# Altium schematic sheet Reference Schematic_2021-02-27.schdoc
size 1415 x 404 mm
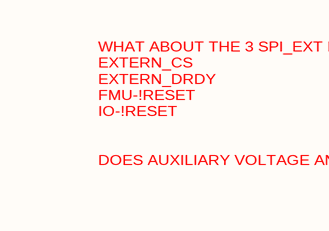
[diagram p0: Reference Schematic_2021-02-27.schdoc, top left]
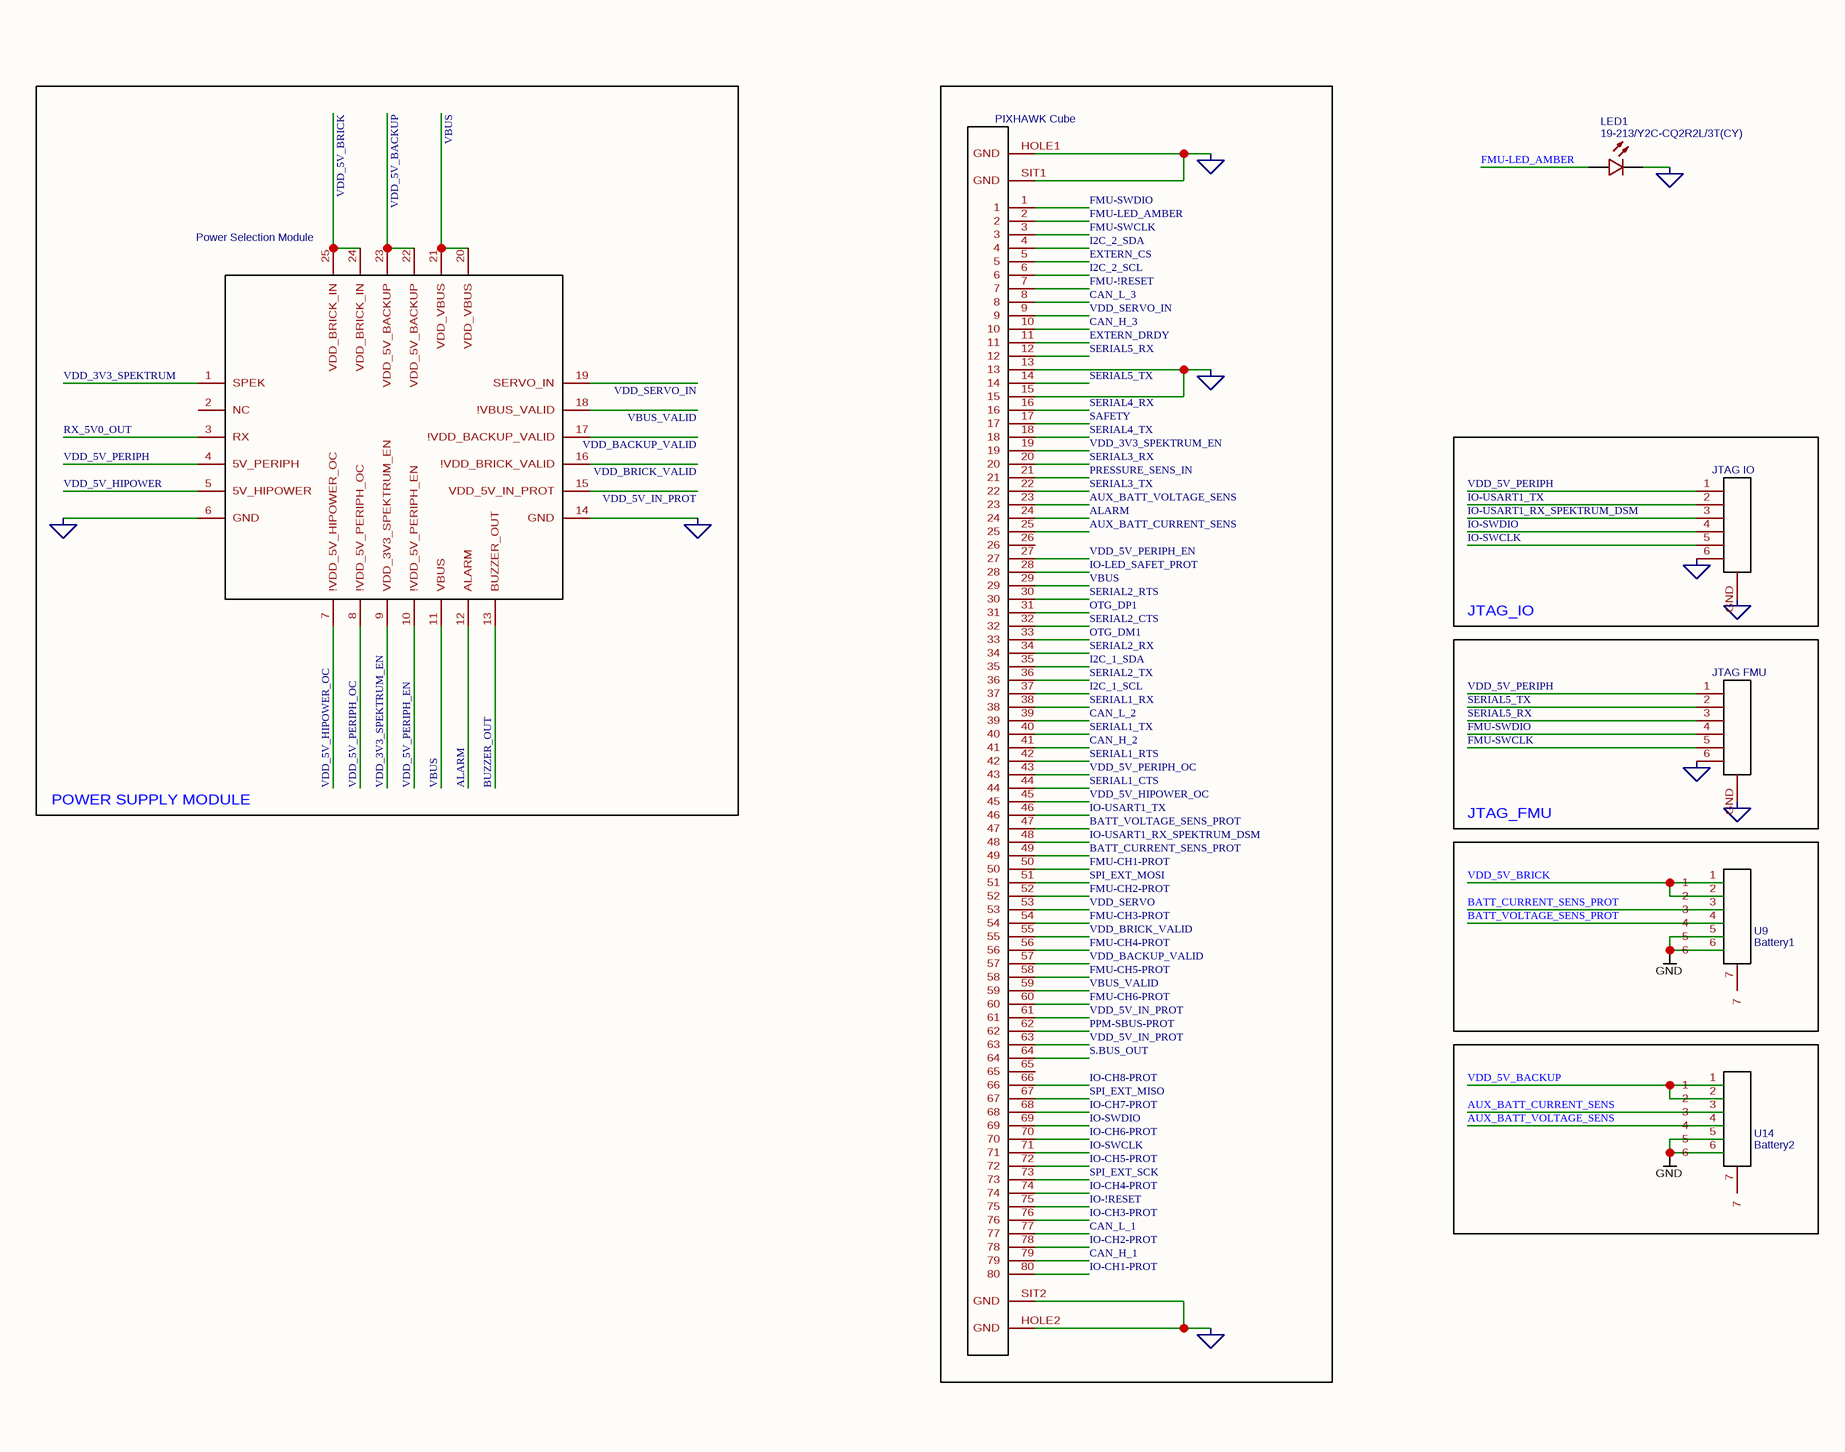
[diagram p1: Reference Schematic_2021-02-27.schdoc, bottom left]
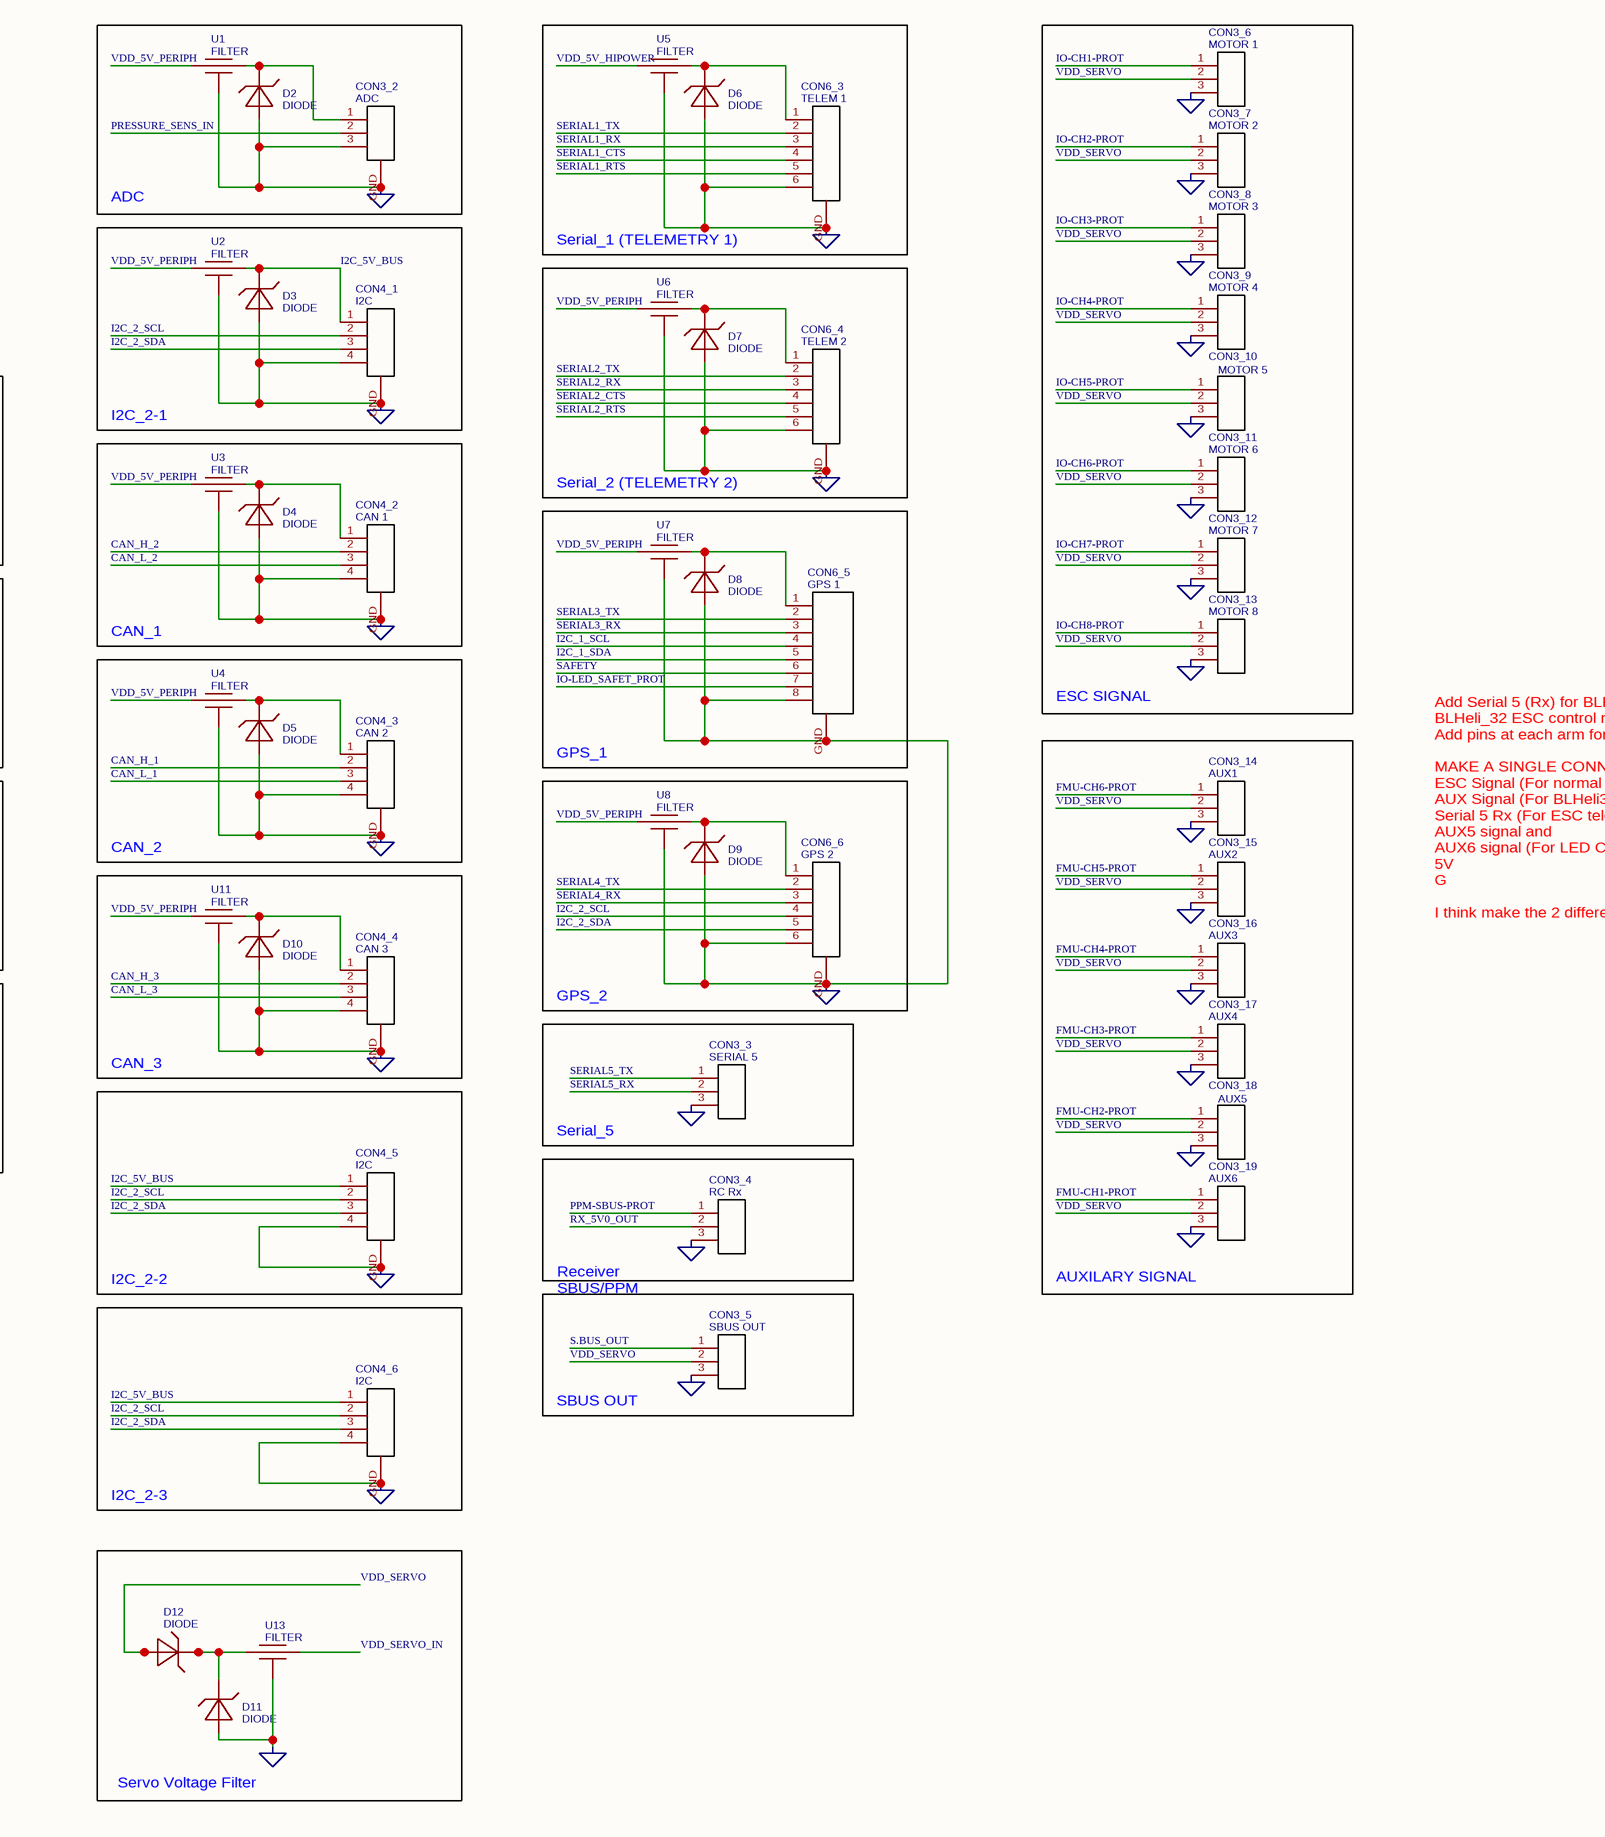
[diagram p2: Reference Schematic_2021-02-27.schdoc, bottom right]

## Parts
CON3_2  ADC  [BM03B-GHS-TBT]
CON3_3  SERIAL 5  [3X1 THROUGH HOLE HEADER]
CON3_4  RC Rx  [3X1 SERVO HEADER]
CON3_5  SBUS OUT  [3X1 SERVO HEADER]
CON3_6  MOTOR 1  [3X1 SERVO HEADER]
CON3_7  MOTOR 2  [3X1 SERVO HEADER]
CON3_8  MOTOR 3  [3X1 SERVO HEADER]
CON3_9  MOTOR 4  [3X1 SERVO HEADER]
CON3_10  MOTOR 5  [3X1 SERVO HEADER]
CON3_11  MOTOR 6  [3X1 SERVO HEADER]
CON3_12  MOTOR 7  [3X1 SERVO HEADER]
CON3_13  MOTOR 8  [3X1 SERVO HEADER]
CON3_14  AUX1  [3X1 THROUGH HOLE HEADER]
CON3_15  AUX2  [3X1 THROUGH HOLE HEADER]
CON3_16  AUX3  [3X1 THROUGH HOLE HEADER]
CON3_17  AUX4  [3X1 THROUGH HOLE HEADER]
CON3_18  AUX5  [3X1 THROUGH HOLE HEADER]
CON3_19  AUX6  [3X1 THROUGH HOLE HEADER]
CON4_1  I2C  [BM04B-GHS-TBT]
CON4_2  CAN 1  [BM04B-GHS-TBT]
CON4_3  CAN 2  [BM04B-GHS-TBT]
CON4_4  CAN 3  [BM04B-GHS-TBT]
CON4_5  I2C  [BM04B-GHS-TBT]
CON4_6  I2C  [BM04B-GHS-TBT]
CON6_1  JTAG IO  [SM06B-SURS-TF]
CON6_2  JTAG FMU  [SM06B-SURS-TF]
CON6_3  TELEM 1  [BM06B-GHS-TBT]
CON6_4  TELEM 2  [BM06B-GHS-TBT]
CON6_5  GPS 1  [BM08B-GHS-TBT]
CON6_6  GPS 2  [BM06B-GHS-TBT]
D2  DIODE  [0402 DIODE]
D3  DIODE  [0402 DIODE]
D4  DIODE  [0402 DIODE]
D5  DIODE  [0402 DIODE]
D6  DIODE  [0402 DIODE]
D7  DIODE  [0402 DIODE]
D8  DIODE  [0402 DIODE]
D9  DIODE  [0402 DIODE]
D10  DIODE  [0402 DIODE]
D11  DIODE  [0402 DIODE]
D12  DIODE  [MSS1P4-M3/89A DIODE]
DF17(1.0H)-80DP-0.5V(57)  PIXHAWK Cube  [CON-DF17-80M]
LED1  19-213/Y2C-CQ2R2L/3T(CY)  [LED0603-R-RD]
PSM  Power Selection Module  [POWER SELECTION MODULE]
U1  FILTER  [0603 LC EMI FILTER]
U2  FILTER  [0603 LC EMI FILTER]
U3  FILTER  [0603 LC EMI FILTER]
U4  FILTER  [0603 LC EMI FILTER]
U5  FILTER  [0603 LC EMI FILTER]
U6  FILTER  [0603 LC EMI FILTER]
U7  FILTER  [0603 LC EMI FILTER]
U8  FILTER  [0603 LC EMI FILTER]
U9  Battery1  [MOLEX CLICKMATE 2.0-6P]
U11  FILTER  [0603 LC EMI FILTER]
U13  FILTER  [0603 LC EMI FILTER]
U14  Battery2  [MOLEX CLICKMATE 2.0-6P]

## Blocks framed on the sheet
POWER SUPPLY MODULE: PSM
ADC: CON3_2 D2 U1
Serial_1 (TELEMETRY 1): CON6_3 D6 U5
ESC SIGNAL: CON3_6-CON3_13
I2C_2-1: CON4_1 D3 U2
Serial_2 (TELEMETRY 2): CON6_4 D7 U6
JTAG_IO: CON6_1
CAN_1: CON4_2 D4 U3
GPS_1: CON6_5 D8 U7
JTAG_FMU: CON6_2
CAN_2: CON4_3 D5 U4
AUXILARY SIGNAL: CON3_14-CON3_19
GPS_2: CON6_6 D9 U8
CAN_3: CON4_4 D10 U11
Serial_5: CON3_3
I2C_2-2: CON4_5
I2C_2-3: CON4_6
SBUS OUT: CON3_5
Servo Voltage Filter: D11 D12 U13

## Nets
GND: CON3_2.3 CON3_2.GND CON3_3.3 CON3_4.3 CON3_5.3 CON3_6.3 CON3_7.3 CON3_8.3 CON3_9.3 CON3_10.3 CON3_11.3 CON3_12.3 CON3_13.3 CON3_14.3 CON3_15.3 CON3_16.3 CON3_17.3 CON3_18.3 CON3_19.3 CON4_1.4 CON4_1.GND CON4_2.4 CON4_2.GND CON4_3.4 CON4_3.GND CON4_4.4 CON4_4.GND CON4_5.4 CON4_5.GND CON4_6.4 CON4_6.GND CON6_1.6 CON6_1.GND CON6_2.6 CON6_2.GND CON6_3.6 CON6_3.GND CON6_4.6 CON6_4.GND CON6_5.8 CON6_5.GND CON6_6.6 CON6_6.GND D2.2 D3.2 D4.2 D5.2 D6.2 D7.2 D8.2 D9.2 D10.2 D11.2 DF17(1.0H)-80DP-0.5V(57).13 DF17(1.0H)-80DP-0.5V(57).15 DF17(1.0H)-80DP-0.5V(57).HOLE1(GND) DF17(1.0H)-80DP-0.5V(57).HOLE2(GND) DF17(1.0H)-80DP-0.5V(57).SIT1(GND) DF17(1.0H)-80DP-0.5V(57).SIT2(GND) LED1.2(C) PSM.6(GND) PSM.14(GND) U1.GND U2.GND U3.GND U4.GND U5.GND U6.GND U7.GND U8.GND U9.5 U9.6 U11.GND U13.GND U14.5 U14.6
ALARM: DF17(1.0H)-80DP-0.5V(57).24 PSM.12(ALARM)
AUX_BATT_CURRENT_SENS: DF17(1.0H)-80DP-0.5V(57).25 U14.3
AUX_BATT_VOLTAGE_SENS: DF17(1.0H)-80DP-0.5V(57).23 U14.4
BATT_CURRENT_SENS_PROT: DF17(1.0H)-80DP-0.5V(57).49 U9.3
BATT_VOLTAGE_SENS_PROT: DF17(1.0H)-80DP-0.5V(57).47 U9.4
BUZZER_OUT: PSM.13(BUZZER_OUT)
CAN_H_1: CON4_3.2 DF17(1.0H)-80DP-0.5V(57).79
CAN_H_2: CON4_2.2 DF17(1.0H)-80DP-0.5V(57).41
CAN_H_3: CON4_4.2 DF17(1.0H)-80DP-0.5V(57).10
CAN_L_1: CON4_3.3 DF17(1.0H)-80DP-0.5V(57).77
CAN_L_2: CON4_2.3 DF17(1.0H)-80DP-0.5V(57).39
CAN_L_3: CON4_4.3 DF17(1.0H)-80DP-0.5V(57).8
EXTERN_CS: DF17(1.0H)-80DP-0.5V(57).5
EXTERN_DRDY: DF17(1.0H)-80DP-0.5V(57).11
FMU-!RESET: DF17(1.0H)-80DP-0.5V(57).7
FMU-CH1-PROT: CON3_19.1 DF17(1.0H)-80DP-0.5V(57).50
FMU-CH2-PROT: CON3_18.1 DF17(1.0H)-80DP-0.5V(57).52
FMU-CH3-PROT: CON3_17.1 DF17(1.0H)-80DP-0.5V(57).54
FMU-CH4-PROT: CON3_16.1 DF17(1.0H)-80DP-0.5V(57).56
FMU-CH5-PROT: CON3_15.1 DF17(1.0H)-80DP-0.5V(57).58
FMU-CH6-PROT: CON3_14.1 DF17(1.0H)-80DP-0.5V(57).60
FMU-LED_AMBER: DF17(1.0H)-80DP-0.5V(57).2 LED1.1(A)
FMU-SWCLK: CON6_2.5 DF17(1.0H)-80DP-0.5V(57).3
FMU-SWDIO: CON6_2.4 DF17(1.0H)-80DP-0.5V(57).1
I2C_1_SCL: CON6_5.4 DF17(1.0H)-80DP-0.5V(57).37
I2C_1_SDA: CON6_5.5 DF17(1.0H)-80DP-0.5V(57).35
I2C_2_SCL: CON4_1.2 CON4_5.2 CON4_6.2 CON6_6.4 DF17(1.0H)-80DP-0.5V(57).6
I2C_2_SDA: CON4_1.3 CON4_5.3 CON4_6.3 CON6_6.5 DF17(1.0H)-80DP-0.5V(57).4
I2C_5V_BUS: CON4_1.1 CON4_5.1 CON4_6.1 D3.1 U2.2
IO-!RESET: DF17(1.0H)-80DP-0.5V(57).75
IO-CH1-PROT: CON3_6.1 DF17(1.0H)-80DP-0.5V(57).80
IO-CH2-PROT: CON3_7.1 DF17(1.0H)-80DP-0.5V(57).78
IO-CH3-PROT: CON3_8.1 DF17(1.0H)-80DP-0.5V(57).76
IO-CH4-PROT: CON3_9.1 DF17(1.0H)-80DP-0.5V(57).74
IO-CH5-PROT: CON3_10.1 DF17(1.0H)-80DP-0.5V(57).72
IO-CH6-PROT: CON3_11.1 DF17(1.0H)-80DP-0.5V(57).70
IO-CH7-PROT: CON3_12.1 DF17(1.0H)-80DP-0.5V(57).68
IO-CH8-PROT: CON3_13.1 DF17(1.0H)-80DP-0.5V(57).66
IO-LED_SAFET_PROT: CON6_5.7 DF17(1.0H)-80DP-0.5V(57).28
IO-SWCLK: CON6_1.5 DF17(1.0H)-80DP-0.5V(57).71
IO-SWDIO: CON6_1.4 DF17(1.0H)-80DP-0.5V(57).69
IO-USART1_RX_SPEKTRUM_DSM: CON6_1.3 DF17(1.0H)-80DP-0.5V(57).48
IO-USART1_TX: CON6_1.2 DF17(1.0H)-80DP-0.5V(57).46
OTG_DM1: DF17(1.0H)-80DP-0.5V(57).33
OTG_DP1: DF17(1.0H)-80DP-0.5V(57).31
PPM-SBUS-PROT: CON3_4.1 DF17(1.0H)-80DP-0.5V(57).62
PRESSURE_SENS_IN: CON3_2.2 DF17(1.0H)-80DP-0.5V(57).21
RX_5V0_OUT: CON3_4.2 PSM.3(RX)
S.BUS_OUT: CON3_5.1 DF17(1.0H)-80DP-0.5V(57).64
SAFETY: CON6_5.6 DF17(1.0H)-80DP-0.5V(57).17
SERIAL1_CTS: CON6_3.4 DF17(1.0H)-80DP-0.5V(57).44
SERIAL1_RTS: CON6_3.5 DF17(1.0H)-80DP-0.5V(57).42
SERIAL1_RX: CON6_3.3 DF17(1.0H)-80DP-0.5V(57).38
SERIAL1_TX: CON6_3.2 DF17(1.0H)-80DP-0.5V(57).40
SERIAL2_CTS: CON6_4.4 DF17(1.0H)-80DP-0.5V(57).32
SERIAL2_RTS: CON6_4.5 DF17(1.0H)-80DP-0.5V(57).30
SERIAL2_RX: CON6_4.3 DF17(1.0H)-80DP-0.5V(57).34
SERIAL2_TX: CON6_4.2 DF17(1.0H)-80DP-0.5V(57).36
SERIAL3_RX: CON6_5.3 DF17(1.0H)-80DP-0.5V(57).20
SERIAL3_TX: CON6_5.2 DF17(1.0H)-80DP-0.5V(57).22
SERIAL4_RX: CON6_6.3 DF17(1.0H)-80DP-0.5V(57).16
SERIAL4_TX: CON6_6.2 DF17(1.0H)-80DP-0.5V(57).18
SERIAL5_RX: CON3_3.2 CON6_2.3 DF17(1.0H)-80DP-0.5V(57).12
SERIAL5_TX: CON3_3.1 CON6_2.2 DF17(1.0H)-80DP-0.5V(57).14
SPI_EXT_MISO: DF17(1.0H)-80DP-0.5V(57).67
SPI_EXT_MOSI: DF17(1.0H)-80DP-0.5V(57).51
SPI_EXT_SCK: DF17(1.0H)-80DP-0.5V(57).73
VBUS: DF17(1.0H)-80DP-0.5V(57).29 PSM.11(VBUS) PSM.20(VDD_VBUS) PSM.21(VDD_VBUS)
VBUS_VALID: DF17(1.0H)-80DP-0.5V(57).59 PSM.18(!VBUS_VALID)
VDD_3V3_SPEKTRUM: PSM.1(SPEK)
VDD_3V3_SPEKTRUM_EN: DF17(1.0H)-80DP-0.5V(57).19 PSM.9(VDD_3V3_SPEKTRUM_EN)
VDD_5V_BACKUP: PSM.22(VDD_5V_BACKUP) PSM.23(VDD_5V_BACKUP) U14.1 U14.2
VDD_5V_BRICK: PSM.24(VDD_BRICK_IN) PSM.25(VDD_BRICK_IN) U9.1 U9.2
VDD_5V_HIPOWER: PSM.5(5V_HIPOWER) U5.1
VDD_5V_HIPOWER_OC: DF17(1.0H)-80DP-0.5V(57).45 PSM.7(!VDD_5V_HIPOWER_OC)
VDD_5V_IN_PROT: DF17(1.0H)-80DP-0.5V(57).61 DF17(1.0H)-80DP-0.5V(57).63 PSM.15(VDD_5V_IN_PROT)
VDD_5V_PERIPH: CON6_1.1 CON6_2.1 PSM.4(5V_PERIPH) U1.1 U2.1 U3.1 U4.1 U6.1 U7.1 U8.1 U11.1
VDD_5V_PERIPH_EN: DF17(1.0H)-80DP-0.5V(57).27 PSM.10(!VDD_5V_PERIPH_EN)
VDD_5V_PERIPH_OC: DF17(1.0H)-80DP-0.5V(57).43 PSM.8(!VDD_5V_PERIPH_OC)
VDD_BACKUP_VALID: DF17(1.0H)-80DP-0.5V(57).57 PSM.17(!VDD_BACKUP_VALID)
VDD_BRICK_VALID: DF17(1.0H)-80DP-0.5V(57).55 PSM.16(!VDD_BRICK_VALID)
VDD_SERVO: CON3_5.2 CON3_6.2 CON3_7.2 CON3_8.2 CON3_9.2 CON3_10.2 CON3_11.2 CON3_12.2 CON3_13.2 CON3_14.2 CON3_15.2 CON3_16.2 CON3_17.2 CON3_18.2 CON3_19.2 D12.2 DF17(1.0H)-80DP-0.5V(57).53
VDD_SERVO_IN: DF17(1.0H)-80DP-0.5V(57).9 PSM.19(SERVO_IN) U13.2
NetCON3_2_1: CON3_2.1 D2.1 U1.2
NetCON4_2_1: CON4_2.1 D4.1 U3.2
NetCON4_3_1: CON4_3.1 D5.1 U4.2
NetCON4_4_1: CON4_4.1 D10.1 U11.2
NetCON6_3_1: CON6_3.1 D6.1 U5.2
NetCON6_4_1: CON6_4.1 D7.1 U6.2
NetCON6_5_1: CON6_5.1 D8.1 U7.2
NetCON6_6_1: CON6_6.1 D9.1 U8.2
NetD11_1: D11.1 D12.1 U13.1

Not connected (* = marked no-connect by the designer): DF17(1.0H)-80DP-0.5V(57) 26 65; PSM 2(NC); U9 7; U14 7

## Notes on the sheet
- WHAT ABOUT THE 3 SPI_EXT PINS? OR: Probably not required.
  EXTERN_CS
  EXTERN_DRDY
  FMU-!RESET
  IO-!RESET
  DOES AUXILIARY VOLTAGE AND CURRENT SENSOR INPUTS NEED TO BE USED? No
- Add Serial 5 (Rx) for BLHeli_32 ESC Telemtry. copy the pins to each arm.
  BLHeli_32 ESC control needs AUX pins
  Add pins at each arm for profiCNC LEDs (AUX PWM 5 and 6)
  MAKE A SINGLE CONNECTION/PLUG FOR EACH ARM, SIMILAR TO THE WAY SOLO DOES IT. INCLUDE:
  ESC Signal (For normal ESC Control
  AUX Signal (For BLHeli32 ESC control)
  Serial 5 Rx (For ESC telemetry)
  AUX5 signal and
  AUX6 signal (For LED Control)
  5V
  G
  I think make the 2 different types of ESC selectable by a jumper, right near the plug
- Receiver
  SBUS/PPM

## Library data of the parts
CON3_2 = ADC: BOM_Manufacturer Part: BM03B-GHS-TBT(LF)(SN)(N); catid: 20; sourceId: i5d7pHZhZ; Description: CONN HEADER GH TOP 3POS 1.25MM; timeStamp: 1458998603; BOM_Supplier: Digi-Key; Link: http://www.jst-mfg.com/product/pdf/eng/eGH.pdf; spicePre: J; BOM_Supplier Part: 455-1579-2-ND
CON3_3 = SERIAL 5: BOM_Manufacturer Part: 894-70-012-10-001101; Contributor: geekness; BOM_Mounted: No; BOM_Supplier: Digi-Key; link: http://www.precidip.com/AppHost/9696,1/Scripts/Modules/Catalog/Default.aspx?c=73&i=450&p=168&pdf=1&dsku=894-PP-NNN-10-001101; spicePre: H; BOM_Supplier Part: 894-70-012-10-001101-ND
CON3_4 = RC Rx: BOM_Manufacturer Part: 894-70-012-10-001101; Contributor: geekness; BOM_Mounted: No; BOM_Supplier: Digi-Key; link: http://www.precidip.com/AppHost/9696,1/Scripts/Modules/Catalog/Default.aspx?c=73&i=450&p=168&pdf=1&dsku=894-PP-NNN-10-001101; spicePre: H; BOM_Supplier Part: 894-70-012-10-001101-ND
CON3_5 = SBUS OUT: BOM_Manufacturer Part: 894-70-012-10-001101; Contributor: geekness; BOM_Mounted: No; BOM_Supplier: Digi-Key; link: http://www.precidip.com/AppHost/9696,1/Scripts/Modules/Catalog/Default.aspx?c=73&i=450&p=168&pdf=1&dsku=894-PP-NNN-10-001101; spicePre: H; BOM_Supplier Part: 894-70-012-10-001101-ND
CON3_6 = MOTOR 1: BOM_Manufacturer Part: 894-70-012-10-001101; Contributor: geekness; BOM_Mounted: No; BOM_Supplier: Digi-Key; link: http://www.precidip.com/AppHost/9696,1/Scripts/Modules/Catalog/Default.aspx?c=73&i=450&p=168&pdf=1&dsku=894-PP-NNN-10-001101; spicePre: H; BOM_Supplier Part: 894-70-012-10-001101-ND
CON3_7 = MOTOR 2: BOM_Manufacturer Part: 894-70-012-10-001101; Contributor: geekness; BOM_Mounted: No; BOM_Supplier: Digi-Key; link: http://www.precidip.com/AppHost/9696,1/Scripts/Modules/Catalog/Default.aspx?c=73&i=450&p=168&pdf=1&dsku=894-PP-NNN-10-001101; spicePre: H; BOM_Supplier Part: 894-70-012-10-001101-ND
CON3_8 = MOTOR 3: BOM_Manufacturer Part: 894-70-012-10-001101; Contributor: geekness; BOM_Mounted: No; BOM_Supplier: Digi-Key; link: http://www.precidip.com/AppHost/9696,1/Scripts/Modules/Catalog/Default.aspx?c=73&i=450&p=168&pdf=1&dsku=894-PP-NNN-10-001101; spicePre: H; BOM_Supplier Part: 894-70-012-10-001101-ND
CON3_9 = MOTOR 4: BOM_Manufacturer Part: 894-70-012-10-001101; Contributor: geekness; BOM_Mounted: No; BOM_Supplier: Digi-Key; link: http://www.precidip.com/AppHost/9696,1/Scripts/Modules/Catalog/Default.aspx?c=73&i=450&p=168&pdf=1&dsku=894-PP-NNN-10-001101; spicePre: H; BOM_Supplier Part: 894-70-012-10-001101-ND
CON3_10 = MOTOR 5: BOM_Manufacturer Part: 894-70-012-10-001101; Contributor: geekness; BOM_Mounted: No; BOM_Supplier: Digi-Key; link: http://www.precidip.com/AppHost/9696,1/Scripts/Modules/Catalog/Default.aspx?c=73&i=450&p=168&pdf=1&dsku=894-PP-NNN-10-001101; spicePre: H; BOM_Supplier Part: 894-70-012-10-001101-ND
CON3_11 = MOTOR 6: BOM_Manufacturer Part: 894-70-012-10-001101; Contributor: geekness; BOM_Mounted: No; BOM_Supplier: Digi-Key; link: http://www.precidip.com/AppHost/9696,1/Scripts/Modules/Catalog/Default.aspx?c=73&i=450&p=168&pdf=1&dsku=894-PP-NNN-10-001101; spicePre: H; BOM_Supplier Part: 894-70-012-10-001101-ND
CON3_12 = MOTOR 7: BOM_Manufacturer Part: 894-70-012-10-001101; Contributor: geekness; BOM_Mounted: No; BOM_Supplier: Digi-Key; link: http://www.precidip.com/AppHost/9696,1/Scripts/Modules/Catalog/Default.aspx?c=73&i=450&p=168&pdf=1&dsku=894-PP-NNN-10-001101; spicePre: H; BOM_Supplier Part: 894-70-012-10-001101-ND
CON3_13 = MOTOR 8: BOM_Manufacturer Part: 894-70-012-10-001101; Contributor: geekness; BOM_Mounted: No; BOM_Supplier: Digi-Key; link: http://www.precidip.com/AppHost/9696,1/Scripts/Modules/Catalog/Default.aspx?c=73&i=450&p=168&pdf=1&dsku=894-PP-NNN-10-001101; spicePre: H; BOM_Supplier Part: 894-70-012-10-001101-ND
CON3_14 = AUX1: BOM_Manufacturer Part: 894-70-012-10-001101; Contributor: geekness; BOM_Mounted: No; BOM_Supplier: Digi-Key; link: http://www.precidip.com/AppHost/9696,1/Scripts/Modules/Catalog/Default.aspx?c=73&i=450&p=168&pdf=1&dsku=894-PP-NNN-10-001101; spicePre: H; BOM_Supplier Part: 894-70-012-10-001101-ND
CON3_15 = AUX2: BOM_Manufacturer Part: 894-70-012-10-001101; Contributor: geekness; BOM_Mounted: No; BOM_Supplier: Digi-Key; link: http://www.precidip.com/AppHost/9696,1/Scripts/Modules/Catalog/Default.aspx?c=73&i=450&p=168&pdf=1&dsku=894-PP-NNN-10-001101; spicePre: H; BOM_Supplier Part: 894-70-012-10-001101-ND
CON3_16 = AUX3: BOM_Manufacturer Part: 894-70-012-10-001101; Contributor: geekness; BOM_Mounted: No; BOM_Supplier: Digi-Key; link: http://www.precidip.com/AppHost/9696,1/Scripts/Modules/Catalog/Default.aspx?c=73&i=450&p=168&pdf=1&dsku=894-PP-NNN-10-001101; spicePre: H; BOM_Supplier Part: 894-70-012-10-001101-ND
CON3_17 = AUX4: BOM_Manufacturer Part: 894-70-012-10-001101; Contributor: geekness; BOM_Mounted: No; BOM_Supplier: Digi-Key; link: http://www.precidip.com/AppHost/9696,1/Scripts/Modules/Catalog/Default.aspx?c=73&i=450&p=168&pdf=1&dsku=894-PP-NNN-10-001101; spicePre: H; BOM_Supplier Part: 894-70-012-10-001101-ND
CON3_18 = AUX5: BOM_Manufacturer Part: 894-70-012-10-001101; Contributor: geekness; BOM_Mounted: No; BOM_Supplier: Digi-Key; link: http://www.precidip.com/AppHost/9696,1/Scripts/Modules/Catalog/Default.aspx?c=73&i=450&p=168&pdf=1&dsku=894-PP-NNN-10-001101; spicePre: H; BOM_Supplier Part: 894-70-012-10-001101-ND
CON3_19 = AUX6: BOM_Manufacturer Part: 894-70-012-10-001101; Contributor: geekness; BOM_Mounted: No; BOM_Supplier: Digi-Key; link: http://www.precidip.com/AppHost/9696,1/Scripts/Modules/Catalog/Default.aspx?c=73&i=450&p=168&pdf=1&dsku=894-PP-NNN-10-001101; spicePre: H; BOM_Supplier Part: 894-70-012-10-001101-ND
CON4_1 CON4_5 CON4_6 = I2C: BOM_Manufacturer Part: BM04B-GHS-TBT(LF)(SN)(N); catid: 20; sourceId: i5d7pHZhZ; Description: CONN HEADER GH TOP 4POS 1.25MM; timeStamp: 1458998603; BOM_Supplier: Digi-Key; Link: http://www.jst-mfg.com/product/pdf/eng/eGH.pdf; spicePre: J; BOM_Supplier Part: 455-1580-2-ND
CON4_2 = CAN 1: BOM_Manufacturer Part: BM04B-GHS-TBT(LF)(SN)(N); catid: 20; sourceId: i5d7pHZhZ; Description: CONN HEADER GH TOP 4POS 1.25MM; timeStamp: 1458998603; BOM_Supplier: Digi-Key; Link: http://www.jst-mfg.com/product/pdf/eng/eGH.pdf; spicePre: J; BOM_Supplier Part: 455-1580-2-ND
CON4_3 = CAN 2: BOM_Manufacturer Part: BM04B-GHS-TBT(LF)(SN)(N); catid: 20; sourceId: i5d7pHZhZ; Description: CONN HEADER GH TOP 4POS 1.25MM; timeStamp: 1458998603; BOM_Supplier: Digi-Key; Link: http://www.jst-mfg.com/product/pdf/eng/eGH.pdf; spicePre: J; BOM_Supplier Part: 455-1580-2-ND
CON4_4 = CAN 3: BOM_Manufacturer Part: BM04B-GHS-TBT(LF)(SN)(N); catid: 20; sourceId: i5d7pHZhZ; Description: CONN HEADER GH TOP 4POS 1.25MM; timeStamp: 1458998603; BOM_Supplier: Digi-Key; Link: http://www.jst-mfg.com/product/pdf/eng/eGH.pdf; spicePre: J; BOM_Supplier Part: 455-1580-2-ND
CON6_1 = JTAG IO: BOM_Manufacturer Part: SM06B-SURS-TF(LF)(SN); catid: 20; sourceId: i5d7pHZhZ; Description: CONN HEADER SUR 6POS .8MM IDC; timeStamp: 1458998603; BOM_Supplier: Digi-Key; Link: http://www.jst-mfg.com/product/pdf/eng/eSUR.pdf; spicePre: J; BOM_Supplier Part: SM06B-SURS-TF(LF)(SN)-ND
CON6_2 = JTAG FMU: BOM_Manufacturer Part: SM06B-SURS-TF(LF)(SN); catid: 20; sourceId: i5d7pHZhZ; Description: CONN HEADER SUR 6POS .8MM IDC; timeStamp: 1458998603; BOM_Supplier: Digi-Key; Link: http://www.jst-mfg.com/product/pdf/eng/eSUR.pdf; spicePre: J; BOM_Supplier Part: SM06B-SURS-TF(LF)(SN)-ND
CON6_3 = TELEM 1: BOM_Manufacturer Part: BM06B-GHS-TBT(LF)(SN)(N); catid: 20; sourceId: i5d7pHZhZ; Description: CONN HEADER GH TOP 6POS 1.25MM; timeStamp: 1458998603; BOM_Supplier: Digi-Key; Link: http://www.jst-mfg.com/product/pdf/eng/eGH.pdf; spicePre: J; BOM_Supplier Part: 455-1582-2-ND
CON6_4 = TELEM 2: BOM_Manufacturer Part: BM06B-GHS-TBT(LF)(SN)(N); catid: 20; sourceId: i5d7pHZhZ; Description: CONN HEADER GH TOP 6POS 1.25MM; timeStamp: 1458998603; BOM_Supplier: Digi-Key; Link: http://www.jst-mfg.com/product/pdf/eng/eGH.pdf; spicePre: J; BOM_Supplier Part: 455-1582-2-ND
CON6_5 = GPS 1: BOM_Manufacturer Part: BM08B-GHS-TBT(LF)(SN)(N); catid: 20; sourceId: i5d7pHZhZ; Description: CONN HEADER GH TOP 8POS 1.25MM; timeStamp: 1458998603; BOM_Supplier: Digi-Key; Link: http://www.jst-mfg.com/product/pdf/eng/eGH.pdf; spicePre: J; BOM_Supplier Part: 455-1584-2-ND
CON6_6 = GPS 2: BOM_Manufacturer Part: BM06B-GHS-TBT(LF)(SN)(N); catid: 20; sourceId: i5d7pHZhZ; Description: CONN HEADER GH TOP 6POS 1.25MM; timeStamp: 1458998603; BOM_Supplier: Digi-Key; Link: http://www.jst-mfg.com/product/pdf/eng/eGH.pdf; spicePre: J; BOM_Supplier Part: 455-1582-2-ND
D2-D11 = DIODE: BOM_Manufacturer Part: PESD0402-140; Contributor: geekness; BOM_Supplier: Mouser; link: http://www.mouser.com/ds/2/240/Littelfuse_Polymer_ESD_Suppressor_PESD0402_140_Pro-1092713.pdf; spicePre: D; BOM_Supplier Part: 650-PESD0402-140
D12 = DIODE: BOM_Manufacturer Part: MSS1P4-M3/89A; Contributor: geekness; BOM_Supplier: Element14; spicePre: D; BOM_Supplier Part: 05W6894
DF17(1.0H)-80DP-0.5V(57) = PIXHAWK Cube: BOM_Manufacturer Part: DF17(1.0H)-80DP-0.5V(57); Contributor: geekness; BOM_Supplier: Mouser; link: http://www.mouser.com/ds/2/185/hirose%20electric_en_df17_20130411-550612.pdf; spicePre: U; BOM_Supplier Part: 798-DF1710H80DP05V57
LED1 = 19-213/Y2C-CQ2R2L/3T(CY): BOM_Manufacturer: EVERLIGHT; SMT Type: Basic; BOM_Supplier: LCSC; BOM_Manufacturer Part: 19-213/Y2C-CQ2R2L/3T(CY); BOM_LCSC Assembly: Yes; image: //image.lceda.cn/szlcsc/C72038.jpg; BOM_Supplier Part: C72038; spicePre: L
PSM = Power Selection Module: Contributor: geekness; BOM_Mounted: No; BOM_Manufacturer Part: Power Selection Module; BOM_Supplier: ProfiCNC; link: http://www.proficnc.com/en/system-kits/84-power-selection-module.html; spicePre: P; BOM_Supplier Part: PSM_C
U1-U8 U11 U13 = FILTER: BOM_Manufacturer Part: NFM18PC104R1C3D; Contributor: geekness; BOM_Supplier: Digi-Key; link: https://media.digikey.com/pdf/Data%20Sheets/AVX%20PDFs/KNH16_Series.pdf; spicePre: U; BOM_Supplier Part: 490-6969-2-ND
U9 = Battery1: BOM_Manufacturer Part: 502443-0670; Contributor: jeff_5225; link: https://www.mouser.com/ProductDetail/Molex/502443-0670?qs=sGAEpiMZZMs%252BGHln7q6pm%252B7BG22ialmxTKfEpMqqlno%3D; spicePre: U
U14 = Battery2: BOM_Manufacturer Part: 502443-0670; Contributor: jeff_5225; link: https://www.mouser.com/ProductDetail/Molex/502443-0670?qs=sGAEpiMZZMs%252BGHln7q6pm%252B7BG22ialmxTKfEpMqqlno%3D; spicePre: U